# Altium schematic sheet Core.SchDoc
size A4; SheetNumber: 1; SheetTotal: 5; SPICEModelCacheADNSXBRB: <root> / <DocumentId>ADNSXBRB</DocumentId> / </root>
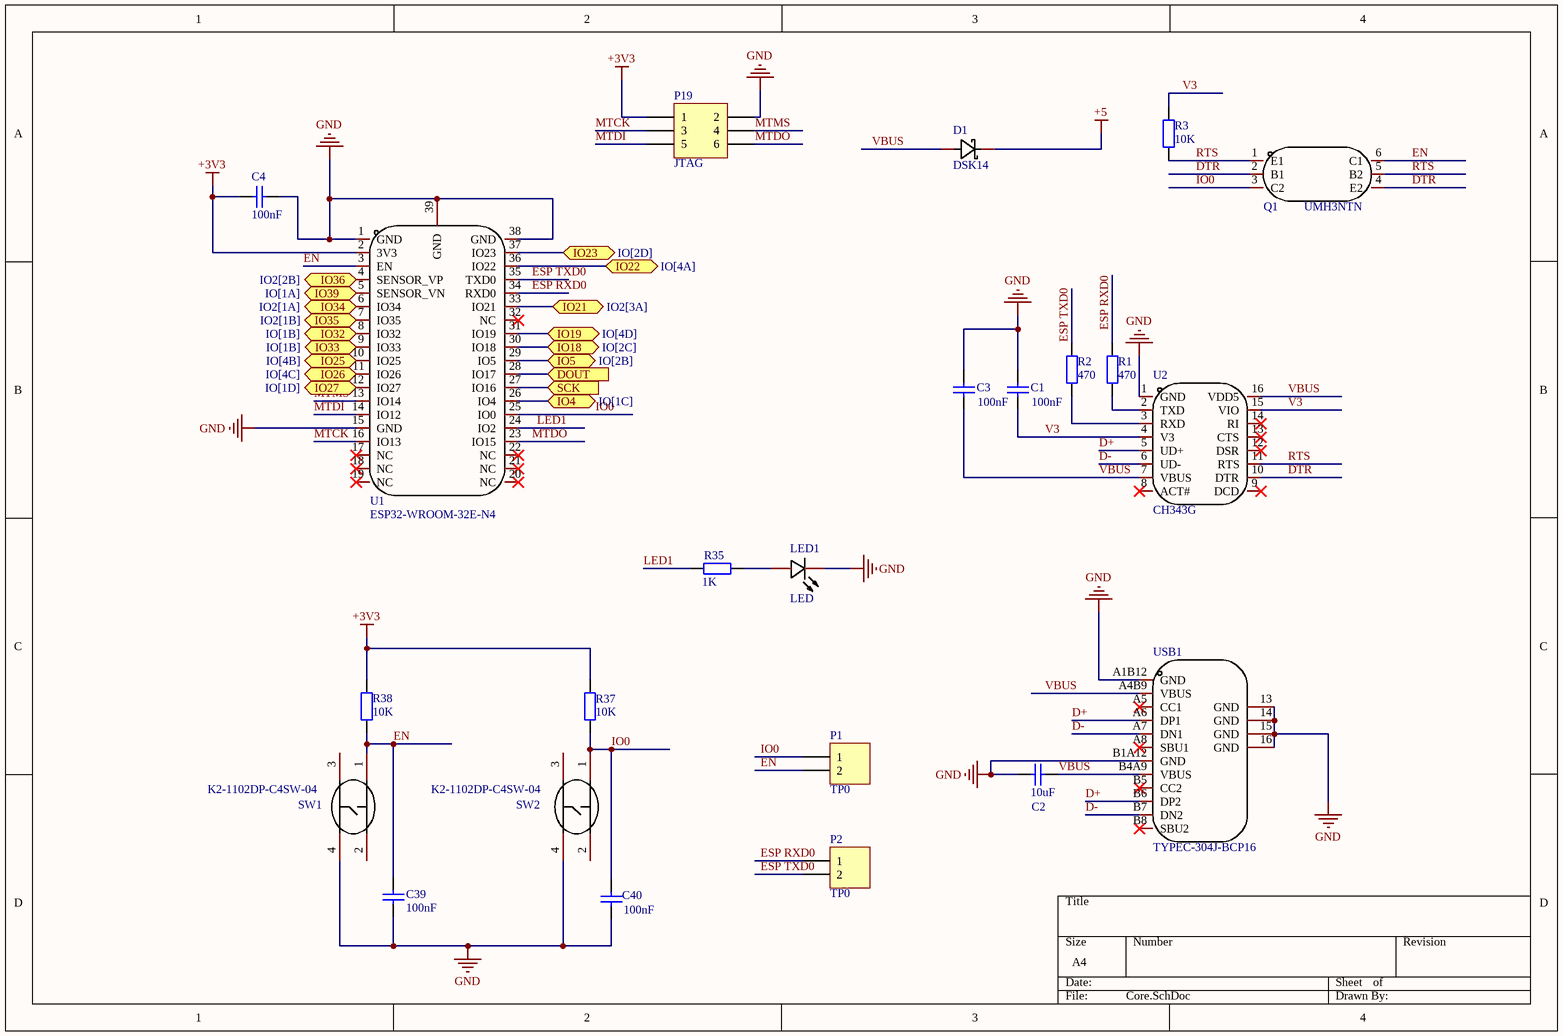
[diagram p0: Core.SchDoc]

## Parts
C1  value 100nF  [6-0805_N]  (hidden comment: Cap)
C2  value 10uF  [6-0805_N]  (hidden comment: Cap)
C3  value 100nF  [6-0805_N]  (hidden comment: Cap)
C4  value 100nF  [6-0805_N]  (hidden comment: Cap)
C39  value 100nF  [6-0805_N]  (hidden comment: Cap)
C40  value 100nF  [6-0805_N]  (hidden comment: Cap)
D1  DSK14  [SOD-123FL_L2.7-W1.8-LS3.8-RD]
LED1  Name: LED  [LED0805-R-RD]  (hidden comment: NCD0805R1)
P1  TP0  [HDR1X2]
P2  TP0  [HDR1X2]
P19  JTAG  [HDR2X3]
Q1  UMH3NTN  [SOT-363_L2.0-W1.3-P0.65-LS2.1-TL]
R1  value 470  [6-0805_N]  (hidden comment: Res2)
R2  value 470  [6-0805_N]  (hidden comment: Res2)
R3  value 10K  [6-0805_N]  (hidden comment: Res2)
R35  value 1K  [6-0805_N]  (hidden comment: Res2)
R37  value 10K  [6-0805_N]  (hidden comment: Res2)
R38  value 10K  [6-0805_N]  (hidden comment: Res2)
SW1  K2-1102DP-C4SW-04  [KEY-TH_4P-L6.0-W6.0-P4.50-LS6.50]
SW2  K2-1102DP-C4SW-04  [KEY-TH_4P-L6.0-W6.0-P4.50-LS6.50]
U1  ESP32-WROOM-32E-N4  [WIFI-SMD_ESP32-WROOM-32E]
U2  CH343G  [SOP-16_L10.0-W3.9-P1.27-LS6.0-BL]
USB1  TYPEC-304J-BCP16  [USB-C-SMD_TYPEC-304J-BCP16]

## Ports
DOUT (in, see Sensor[3A]), IO4 (bidir, see IO[1C]), IO5 (bidir, see IO[2B]), IO18 (bidir, see IO[2C]), IO19 (bidir, see IO[4D]), IO21 (bidir, see IO2[3A]), IO22 (bidir, see IO[4A]), IO23 (bidir, see IO[2D]), IO25 (bidir, see IO[4B]), IO26 (bidir, see IO[4C]), IO27 (bidir, see IO[1D]), IO32 (bidir, see IO[1B]), IO33 (bidir, see IO[1B]), IO34 (bidir, see IO2[1A]), IO35 (bidir, see IO2[1B]), IO36 (bidir, see IO2[2B]), IO39 (bidir, see IO[1A]), SCK (in, see Sensor[3A])

## Nets
+3V3: C4.2 P19.1 R37.2 R38.2 U1.2(3V3)
+5: D1.1(K)
GND: C1.2 C2.2 C3.2 C4.1 C39.1 C40.1 LED1.2(-) P19.2 SW1.4 SW2.4 U1.1(GND) U1.15(GND) U1.38(GND) U1.39(GND) U2.1(GND) USB1.13(GND) USB1.14(GND) USB1.15(GND) USB1.16(GND) USB1.A1B12(GND) USB1.B1A12(GND)
D+: U2.5(UD+) USB1.A6(DP1) USB1.B6(DP2)
D-: U2.6(UD-) USB1.A7(DN1) USB1.B7(DN2)
DOUT: U1.28(IO17) ; port DOUT
DTR: Q1.2(B1) Q1.4(E2) U2.10(DTR)
EN: C39.2 P1.2 Q1.6(C1) R38.1 SW1.1 U1.3(EN)
ESP RXD0: P2.1 R1.2 U1.34(RXD0)
ESP TXD0: P2.2 R2.2 U1.35(TXD0)
IO0: C40.2 P1.1 Q1.3(C2) R37.1 SW2.1 U1.25(IO0)
IO4: U1.26(IO4) ; port IO4
IO5: U1.29(IO5) ; port IO5
IO18: U1.30(IO18) ; port IO18
IO19: U1.31(IO19) ; port IO19
IO21: U1.33(IO21) ; port IO21
IO22: U1.36(IO22) ; port IO22
IO23: U1.37(IO23) ; port IO23
IO25: U1.10(IO25) ; port IO25
IO26: U1.11(IO26) ; port IO26
IO27: U1.12(IO27) ; port IO27
IO32: U1.8(IO32) ; port IO32
IO33: U1.9(IO33) ; port IO33
IO34: U1.6(IO34) ; port IO34
IO35: U1.7(IO35) ; port IO35
IO36: U1.4(SENSOR_VP) ; port IO36
IO39: U1.5(SENSOR_VN) ; port IO39
LED1: R35.1 U1.24(IO2)
MTCK: P19.3 U1.16(IO13)
MTDI: P19.5 U1.14(IO12)
MTDO: P19.6 U1.23(IO15)
MTMS: P19.4 U1.13(IO14)
RTS: Q1.1(E1) Q1.5(B2) R3.1 U2.11(RTS)
SCK: U1.27(IO16) ; port SCK
V3: C1.1 R3.2 U2.4(V3) U2.15(VIO)
VBUS: C2.1 C3.1 D1.2(A) U2.7(VBUS) U2.16(VDD5) USB1.A4B9(VBUS) USB1.B4A9(VBUS)
NetLED1_1: LED1.1(+) R35.2
NetR1_1: R1.1 U2.2(TXD)
NetR2_1: R2.1 U2.3(RXD)

Not connected (* = marked no-connect by the designer): SW1 2 3; SW2 2 3; U1 17(NC)* 18(NC)* 19(NC)* 20(NC)* 21(NC)* 22(NC)* 32(NC)*; U2 8(ACT#)* 9(DCD)* 12(DSR)* 13(CTS)* 14(RI)*; USB1 A5(CC1)* A8(SBU1)* B5(CC2)* B8(SBU2)*

## Library data of the parts
C1-C4 C39 C40 = Cap: Capacitor; Published: 8-Jun-2000; LatestRevisionDate: 17-Jul-2002; LatestRevisionNote: Re-released for DXP Platform.; PackageReference: RAD-0.3; Publisher: Altium Limited; PackageDescription: Radial Cap, Thru-Hole; 2 Leads; 0.3 in Pin Spacing
D1 = DSK14_C7502711: Manufacturer: 宏迦橙; Add into BOM: yes; Diode Configuration: 独立式; Forward Voltage (Vf@If): 550mV@1A; Reverse Voltage (Vr): 40V; Rectified Current: 1A; Reverse Leakage Current (Ir): 500uA; Symbol: DSK14_C7502711; Device: DSK14_C7502711; LCSC Part Name: 电压:40V 电流:1A; Supplier Part: C7502711; Manufacturer Part: DSK14; Supplier Footprint: SOD-123FL; JLCPCB Part Class: Extended Part; Datasheet: https://atta.szlcsc.com/upload/public/pdf/source/20240814/0CEB0199A0D437A3D615A8EF61306643.pdf; Supplier: LCSC; Convert to PCB: yes; Name: DSK14
LED1 = NCD0805R1: Manufacturer: 国星光电; Symbol: FC-2012HRK-620D; Add into BOM: yes; Emitted Color: 红色; Forward Voltage (VF): 1.6V~2.6V; Power Dissipation: 65mW; Forward Current: 20mA; Dominant Wavelength: 615nm~630nm; Diode Configuration: 独立二极管; Lens Color: 无色透明透镜; Luminous Intensity: 67mcd~195mcd; Viewing Angle: 130°; Device: NCD0805R1; LCSC Part Name: NCD0805R1; Supplier Part: C84256; Manufacturer Part: NCD0805R1; Supplier Footprint: 0805; JLCPCB Part Class: 基础库; Datasheet: https://atta.szlcsc.com/upload/public/pdf/source/20200820/C84256_F0A75A43B3EAD75808600A0514C76B99.pdf; Supplier: LCSC; Convert to PCB: yes; Lamp Holder Type: -; Peak Wavelength: -; Color Temperature: -; Mounting Sytle: -; Operating Temperature: -30℃~+85℃
P1 P2 = Header 2: Header, 2-Pin; LatestRevisionDate: 17-Jul-2002; LatestRevisionNote: Re-released for DXP Platform.; Publisher: Altium Limited
P19 = Header 3X2: Header, 3-Pin, Dual row; LatestRevisionDate: 17-Jul-2002; LatestRevisionNote: Re-released for DXP Platform.; Publisher: Altium Limited
Q1 = UMH3NTN: Manufacturer: ROHM(罗姆); Add into BOM: yes; Collector-Emitter Breakdown Voltage (Vceo): 50V; Collector Current (Ic): 100mA; Power Dissipation (Pd): 150mW; DC Current Gain (hFE@Ic,Vce): 100@1mA,5V; Symbol: UMH3NTN; Device: UMH3NTN; LCSC Part Name: 耐压:50V 电流:100mA; Supplier Part: C123008; Manufacturer Part: UMH3NTN; Supplier Footprint: SOT-363; JLCPCB Part Class: 扩展库; Datasheet: https://atta.szlcsc.com/upload/public/pdf/source/20170726/C123008_1501054486996843958.pdf; Supplier: LCSC; Convert to PCB: yes; Transistor Type: -; Name: UMH3NTN
R1-R3 R35 R37 R38 = Res2: Resistor; Published: 8-Jun-2000; LatestRevisionDate: 17-Jul-2002; LatestRevisionNote: Re-released for DXP Platform.; PackageReference: AXIAL-0.4; Publisher: Altium Limited; PackageDescription: Axial Device, Thru-Hole; 2 Leads; 0.4 in Pin Spacing
SW1 SW2 = K2-1102DP-C4SW-04: Manufacturer: 韩国韩荣; Add into BOM: yes; Circuit: 单刀单掷; Actuator Style: 圆形按钮; Operating Force: 2.5N; Switch Length: 6mm; Switch Height: 5mm; Contact Current: 50mA; Voltage Rating (DC): 12V; Insulation Resistance: 100MΩ; Mechanical Life: 10万次; Symbol: K2-1102DP-C4SW-04; Device: K2-1102DP-C4SW-04; LCSC Part Name: 轻触按键开关6*6*5; Supplier Part: C110153; Manufacturer Part: K2-1102DP-C4SW-04; Supplier Footprint: 插件; JLCPCB Part Class: 扩展库; Datasheet: https://atta.szlcsc.com/upload/public/pdf/source/20210810/D0CD9D77408EACA829A5E533AC6E5B1E.pdf; Supplier: LCSC; Convert to PCB: yes; Mounting Style: 直插; Switch Width: 6mm; With Lamp: -; Operating Temperature: -25℃~+85℃; K2-1102DP-C4SW-04: K2-1102DP-C4SW-04
U1 = ESP32-WROOM-32E-N4: Manufacturer: ESPRESSIF(乐鑫); Symbol: ESP32-WROOM-32E(4MB); Add into BOM: yes; Device: ESP32-WROOM-32E-N4; LCSC Part Name: 通用型Wi-Fi+BT+BLE MCU模组; Supplier Part: C701341; Manufacturer Part: ESP32-WROOM-32E-N4; Supplier Footprint: SMD,18x25.5mm; JLCPCB Part Class: 扩展库; Datasheet: https://atta.szlcsc.com/upload/public/pdf/source/20220601/0020821B65DE5740BBACA5FACC5CF3B6.pdf; Supplier: LCSC; Convert to PCB: yes; ESP32-WROOM-32E-N4: ESP32-WROOM-32E-N4
U2 = CH343G: Manufacturer: WCH(南京沁恒); Add into BOM: yes; Symbol: CH343G; Device: CH343G; Supplier: LCSC; Supplier Part: C2844153; Manufacturer Part: CH343G; JLCPCB Part Class: 扩展库; LCSC Part Name: CH343G; Supplier Footprint: SOP-16; Datasheet: https://atta.szlcsc.com/upload/public/pdf/source/20211010/C2846043_7FA705E1F14A2906F6A2AFA45FA28209.pdf; Convert to PCB: yes; Applications Function: -; Protocol: -; Name: CH343G
USB1 = TYPEC-304J-BCP16: Manufacturer: XUNPU(讯普); Add into BOM: yes; Connector Type: Type-C; Gender: 母; Number of Ports: 1; Number of Contacts: 16P; Current Rating - Power (Max): 5A; Soldering Temperature(Max): 260℃; Symbol: TYPEC-304J-BCP16; Device: TYPEC-304J-BCP16; Supplier: LCSC; Supplier Part: C2835315; Manufacturer Part: TYPEC-304J-BCP16; JLCPCB Part Class: 扩展库; LCSC Part Name: Type-C 母 卧贴; Supplier Footprint: SMD; Datasheet: https://atta.szlcsc.com/upload/public/pdf/source/20210528/C2835315_A76BD3CF9329D12B6041421AD23BFD66.pdf; Convert to PCB: yes; Standard: USB 3.1; Mounting Style: 卧贴; Operating Temperature Range: -40℃~+85℃; Name: TYPEC-304J-BCP16